# EAGLE design Xonik Waveshaper v1.0 w gp (EAGLE 6.5.0)
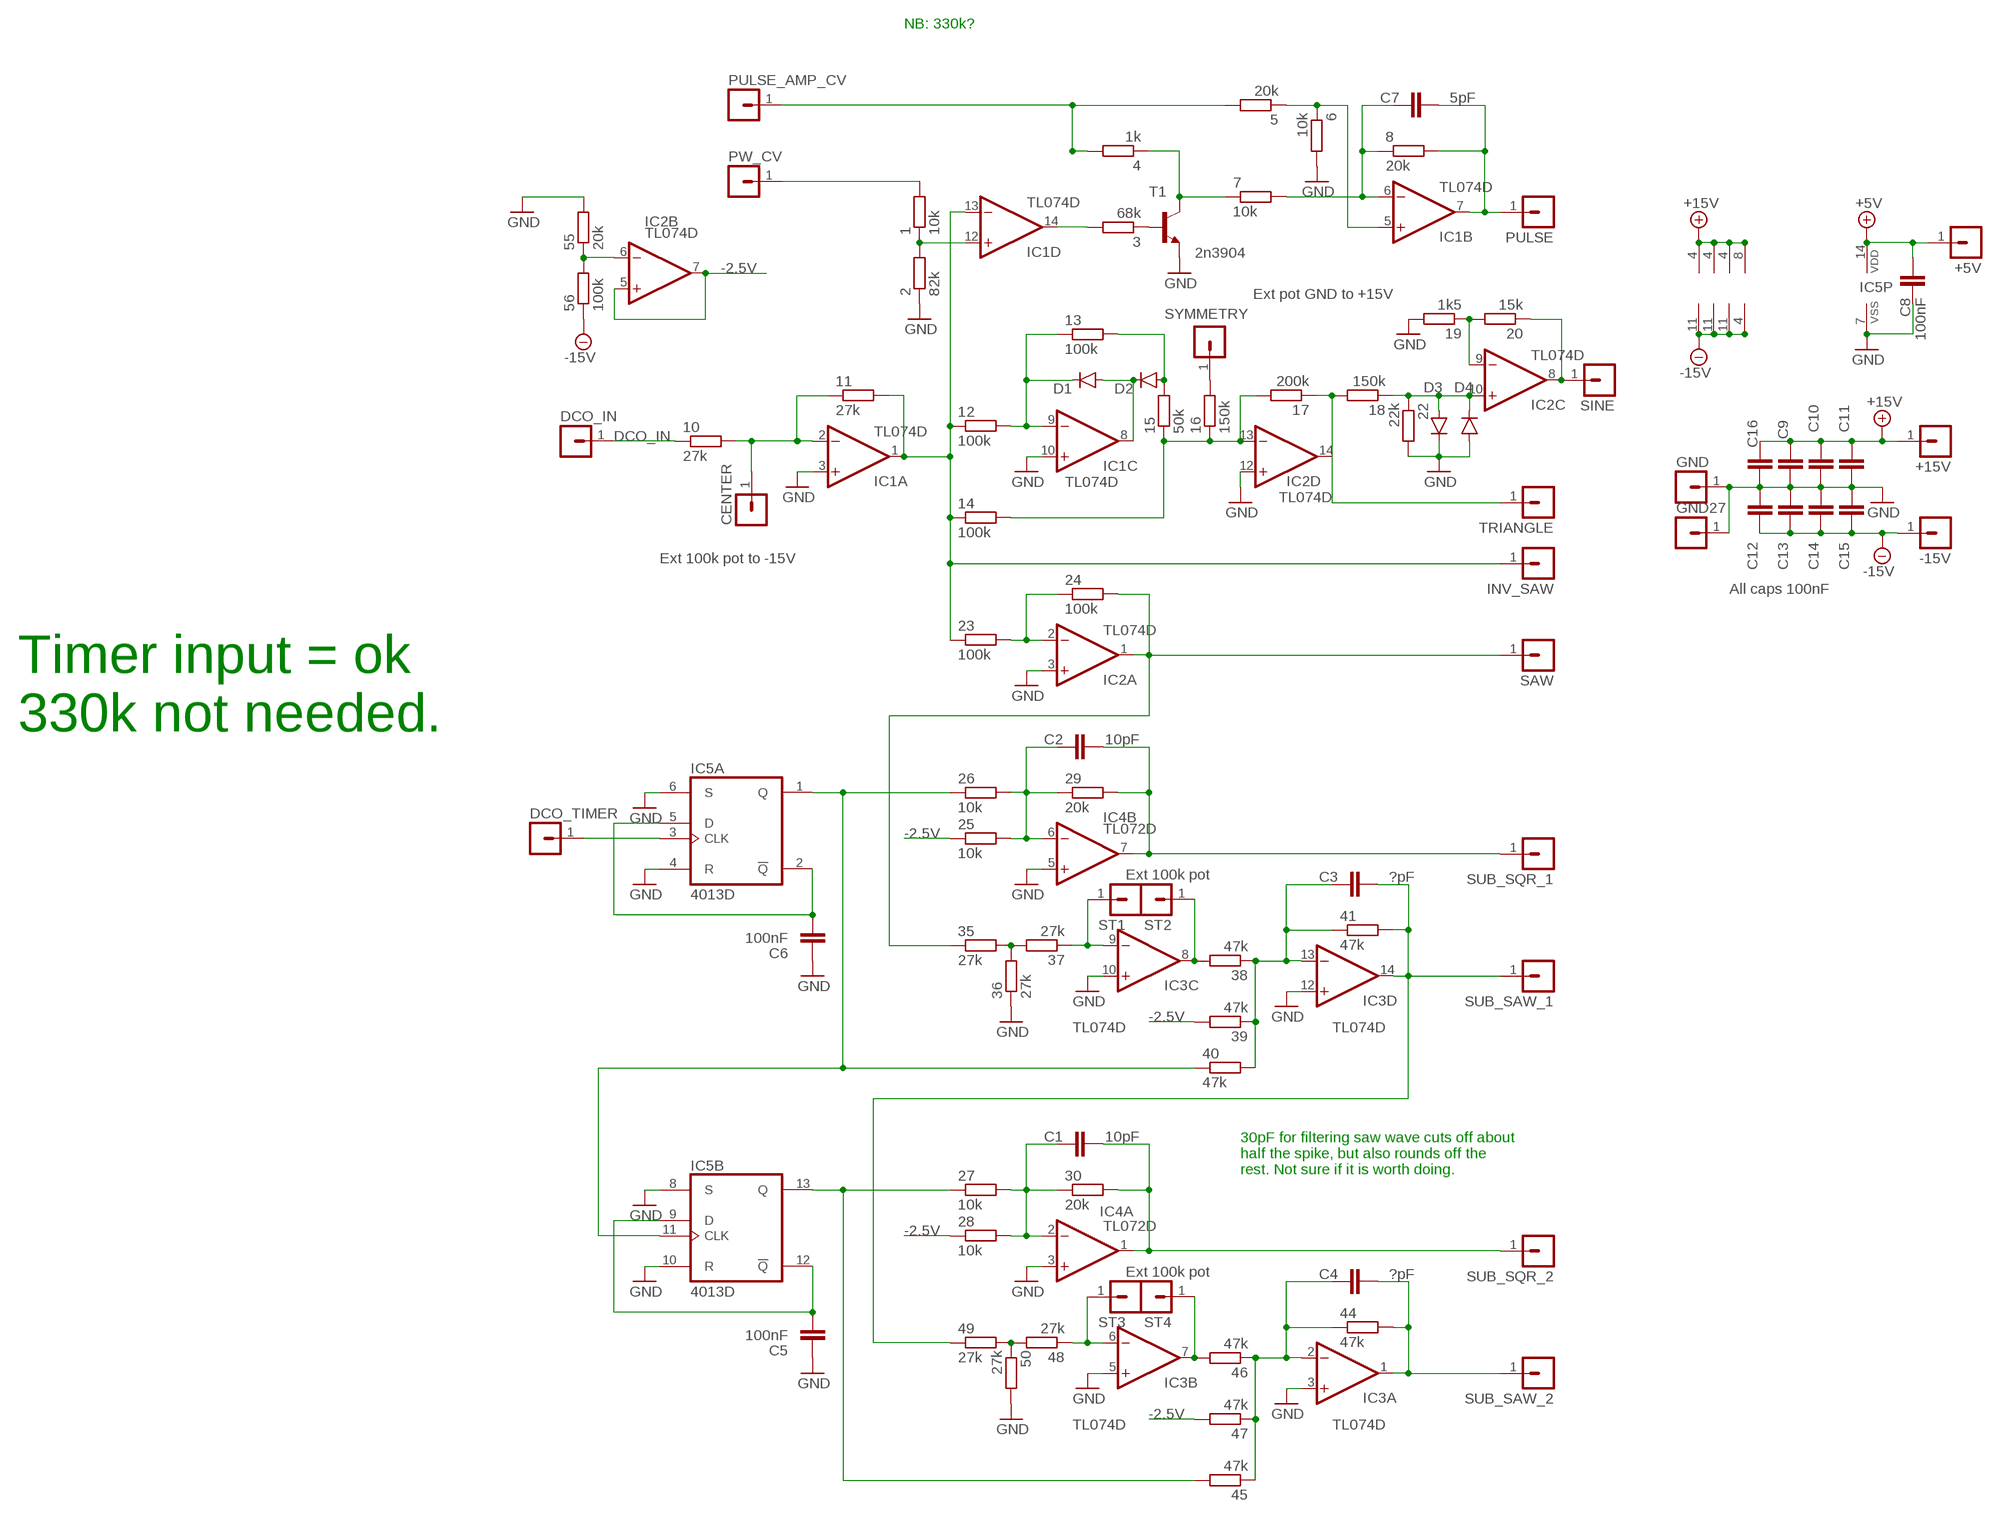
[diagram p0: schematic, sheet 1]

## Parts
1  10k  R-EU_R0805  [R0805]
2  82k  R-EU_R0805  [R0805]
3  68k  R-EU_R0805  [R0805]
4  1k  R-EU_R0805  [R0805]
5  20k  R-EU_R0805  [R0805]
6  10k  R-EU_R0805  [R0805]
7  10k  R-EU_R0805  [R0805]
8  20k  R-EU_R0805  [R0805]
10  27k  R-EU_R0805  [R0805]
11  27k  R-EU_R0805  [R0805]
12  100k  R-EU_R0805  [R0805]
13  100k  R-EU_R0805  [R0805]
14  100k  R-EU_R0805  [R0805]
15  50k  R-EU_R0805  [R0805]
16  150k  R-EU_R0805  [R0805]
17  200k  R-EU_R0805  [R0805]
18  150k  R-EU_R0805  [R0805]
19  1k5  R-EU_R0805  [R0805]
20  15k  R-EU_R0805  [R0805]
22  22k  R-EU_R0805  [R0805]
23  100k  R-EU_R0805  [R0805]
24  100k  R-EU_R0805  [R0805]
25  10k  R-EU_R0805  [R0805]
26  10k  R-EU_R0805  [R0805]
27  10k  R-EU_R0805  [R0805]
28  10k  R-EU_R0805  [R0805]
29  20k  R-EU_R0805  [R0805]
30  20k  R-EU_R0805  [R0805]
35  27k  R-EU_R0805  [R0805]
36  27k  R-EU_R0805  [R0805]
37  27k  R-EU_R0805  [R0805]
38  47k  R-EU_R0805  [R0805]
39  47k  R-EU_R0805  [R0805]
40  47k  R-EU_R0805  [R0805]
41  47k  R-EU_R0805  [R0805]
44  47k  R-EU_R0805  [R0805]
45  47k  R-EU_R0805  [R0805]
46  47k  R-EU_R0805  [R0805]
47  47k  R-EU_R0805  [R0805]
48  27k  R-EU_R0805  [R0805]
49  27k  R-EU_R0805  [R0805]
50  27k  R-EU_R0805  [R0805]
55  20k  R-EU_R0805  [R0805]
56  100k  R-EU_R0805  [R0805]
+5V  MA01-1JP  [SIP-PIN01-1J]
+15V  MA01-1JP  [SIP-PIN01-1J]
-15V  MA01-1JP  [SIP-PIN01-1J]
C1  10pF  C-EUC0805  [C0805]
C2  10pF  C-EUC0805  [C0805]
C3  ?pF  C-EUC0805  [C0805]
C4  ?pF  C-EUC0805  [C0805]
C5  100nF  C-EUC0805  [C0805]
C6  100nF  C-EUC0805  [C0805]
C7  5pF  C-EUC0805  [C0805]
C8  100nF  C-EUC0805  [C0805]
C9  100nF  C-EUC0603K  [C0603K]
C10  100nF  C-EUC0603K  [C0603K]
C11  100nF  C-EUC0603K  [C0603K]
C12  100nF  C-EUC0603K  [C0603K]
C13  100nF  C-EUC0603K  [C0603K]
C14  100nF  C-EUC0603K  [C0603K]
C15  100nF  C-EUC0603K  [C0603K]
C16  100nF  C-EUC0603K  [C0603K]
CENTER  MA01-1JP  [SIP-PIN01-1J]
D1  1N41480805  [D0805-J]
D2  1N41480805  [D0805-J]
D3  1N41480805  [D0805-J]
D4  1N41480805  [D0805-J]
DCO_IN  MA01-1JP  [SIP-PIN01-1J]
DCO_TIMER  MA01-1JP  [SIP-PIN01-1J]
GND  MA01-1JP  [SIP-PIN01-1J]
GND27  MA01-1JP  [SIP-PIN01-1J]
IC1  TL074D  [SO14]
IC2  TL074D  [SO14]
IC3  TL074D  [SO14]
IC4  TL072D  [SO08J]
IC5  4013D  [SO14J]
INV_SAW  MA01-1JP  [SIP-PIN01-1J]
PULSE  MA01-1JP  [SIP-PIN01-1J]
PULSE_AMP_CV  MA01-1JP  [SIP-PIN01-1J]
PW_CV  MA01-1JP  [SIP-PIN01-1J]
SAW  MA01-1JP  [SIP-PIN01-1J]
SINE  MA01-1JP  [SIP-PIN01-1J]
ST1  MA01-1JP  [SIP-PIN01-1J]
ST2  MA01-1JP  [SIP-PIN01-1J]
ST3  MA01-1JP  [SIP-PIN01-1J]
ST4  MA01-1JP  [SIP-PIN01-1J]
SUB_SAW_1  MA01-1JP  [SIP-PIN01-1J]
SUB_SAW_2  MA01-1JP  [SIP-PIN01-1J]
SUB_SQR_1  MA01-1JP  [SIP-PIN01-1J]
SUB_SQR_2  MA01-1JP  [SIP-PIN01-1J]
SYMMETRY  MA01-1JP  [SIP-PIN01-1J]
T1  2n3904  MMBT3904LT1-NPN-SOT23-BEC  [SOT23-BEC]
TRIANGLE  MA01-1JP  [SIP-PIN01-1J]

## Nets
+5V: +5V.1 C8.2 IC5.14(P:VDD)
+15V: +15V.1 C9.2 C10.2 C11.2 C16.2 IC1.4(P:V+) IC2.4(P:V+) IC3.4(P:V+) IC4.8(P:V+)
-2.5V: 25.1 28.1 39.2 47.2 IC2.5(B:+IN) IC2.7(B:OUT)
-15V: 56.1 -15V.1 C12.1 C13.1 C14.1 C15.1 IC1.11(P:V-) IC2.11(P:V-) IC3.11(P:V-) IC4.4(P:V-)
AMP_CV: 4.2 5.2 PULSE_AMP_CV.1
DCO_IN: 10.1 DCO_IN.1
GND: 2.1 6.2 19.2 22.2 36.1 50.2 55.2 C5.1 C6.1 C8.1 C9.1 C10.1 C11.1 C12.2 C13.2 C14.2 C15.2 C16.1 D3.C D4.A GND27.1 GND.1 IC1.3(A:+IN) IC1.10(C:+IN) IC2.3(A:+IN) IC2.12(D:+IN) IC3.3(A:+IN) IC3.5(B:+IN) IC3.10(C:+IN) IC3.12(D:+IN) IC4.3(A:+IN) IC4.5(B:+IN) IC5.4(A:R) IC5.6(A:S) IC5.7(P:VSS) IC5.8(B:S) IC5.10(B:R) T1.E
N$1: 1.1 2.2 IC1.12(D:+IN)
N$2: 3.2 IC1.14(D:OUT)
N$3: 3.1 T1.B
N$4: 4.1 7.1 T1.C
N$5: 5.1 6.1 IC1.5(B:+IN)
N$6: 7.2 8.1 C7.1 IC1.6(B:-IN)
N$7: 8.2 C7.2 IC1.7(B:OUT) PULSE.1
N$9: 11.2 12.1 14.1 23.1 IC1.1(A:OUT) IC1.13(D:-IN) INV_SAW.1
N$10: 10.2 11.1 CENTER.1 IC1.2(A:-IN)
N$11: 12.2 13.1 D1.C IC1.9(C:-IN)
N$12: D1.A D2.C IC1.8(C:OUT)
N$13: 13.2 15.2 D2.A
N$14: 14.2 15.1 16.1 17.2 IC2.13(D:-IN)
N$15: 23.2 24.1 IC2.2(A:-IN)
N$16: 24.2 35.1 IC2.1(A:OUT) SAW.1
N$17: 29.2 C2.2 IC4.7(B:OUT) SUB_SQR_1.1
N$18: 30.2 C1.2 IC4.1(A:OUT) SUB_SQR_2.1
N$19: 25.2 26.2 29.1 C2.1 IC4.6(B:-IN)
N$20: 46.2 IC3.7(B:OUT) ST4.1
N$21: 48.2 49.2 50.1
N$22: 27.2 28.2 30.1 C1.1 IC4.2(A:-IN)
N$23: 35.2 36.2 37.2
N$24: 37.1 IC3.9(C:-IN) ST1.1
N$26: 38.1 39.1 40.2 41.1 C3.1 IC3.13(D:-IN)
N$27: 41.2 49.1 C3.2 IC3.14(D:OUT) SUB_SAW_1.1
N$28: 48.1 IC3.6(B:-IN) ST3.1
N$29: 44.1 45.1 46.1 47.1 C4.1 IC3.2(A:-IN)
N$30: 44.2 C4.2 IC3.1(A:OUT) SUB_SAW_2.1
N$31: C6.2 IC5.2(A:!Q) IC5.5(A:D)
N$32: 26.1 40.1 IC5.1(A:Q) IC5.11(B:CLK)
N$33: 55.1 56.2 IC2.6(B:-IN)
N$34: C5.2 IC5.9(B:D) IC5.12(B:!Q)
N$35: 27.1 45.2 IC5.13(B:Q)
N$36: 19.1 20.2 IC2.9(C:-IN)
N$37: 16.2 SYMMETRY.1
N$38: 17.1 18.2 IC2.14(D:OUT) TRIANGLE.1
N$39: 18.1 22.1 D3.A D4.C IC2.10(C:+IN)
N$40: 20.1 IC2.8(C:OUT) SINE.1
N$41: 38.2 IC3.8(C:OUT) ST2.1
PW_CV: 1.2 PW_CV.1
SQR: DCO_TIMER.1 IC5.3(A:CLK)

## Notes on the sheet
- NB: 330k?
- Ext pot GND to +15V
- Ext 100k pot to -15V
- All caps 100nF
- Timer input = ok
  330k not needed.
- Ext 100k pot
- 30pF for filtering saw wave cuts off about
  half the spike, but also rounds off the
  rest. Not sure if it is worth doing.
- Ext 100k pot

## Library data of the parts
1-8 10-20 22-30 35-41 44-50 55 56 = resistor:R-EU_: RESISTOR, European symbol
+5V +15V -15V CENTER DCO_IN DCO_TIMER GND GND27 INV_SAW PULSE PULSE_AMP_CV PW_CV SAW SINE ST1-ST4 SUB_SAW_1 SUB_SAW_2 SUB_SQR_1 SUB_SQR_2 SYMMETRY TRIANGLE = joakim:MA01-1J: PIN HEADER
C1-C16 = resistor:C-EU: CAPACITOR, European symbol
D1-D4 = joakim:1N4148: DIODE high speed (Philips)
IC1-IC3 = linear:TL074: OP AMP
IC4 = joakim:TL072: OP AMP
IC5 = joakim:4013: Dual D FLIP FLOP, set/reset
T1 = transistor-neu-to92:*-NPN-: NPN Transistror

## Board
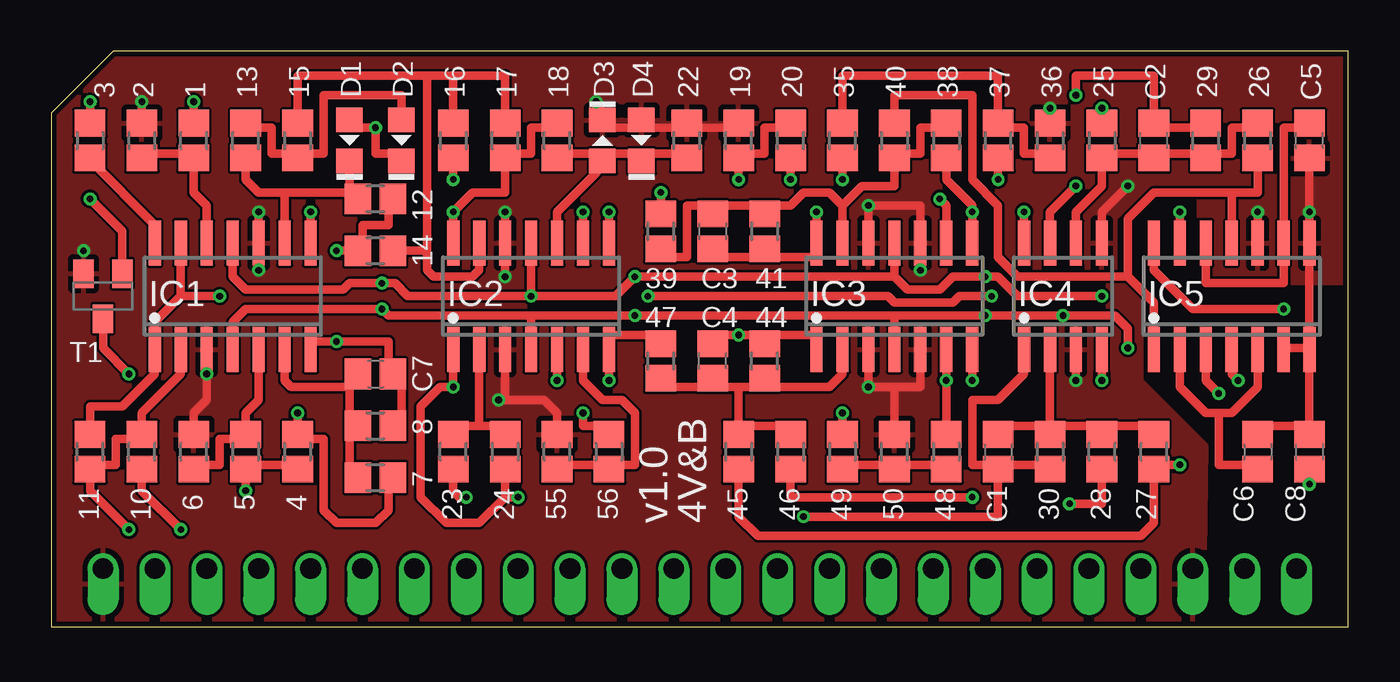
[diagram p1: board, top side]
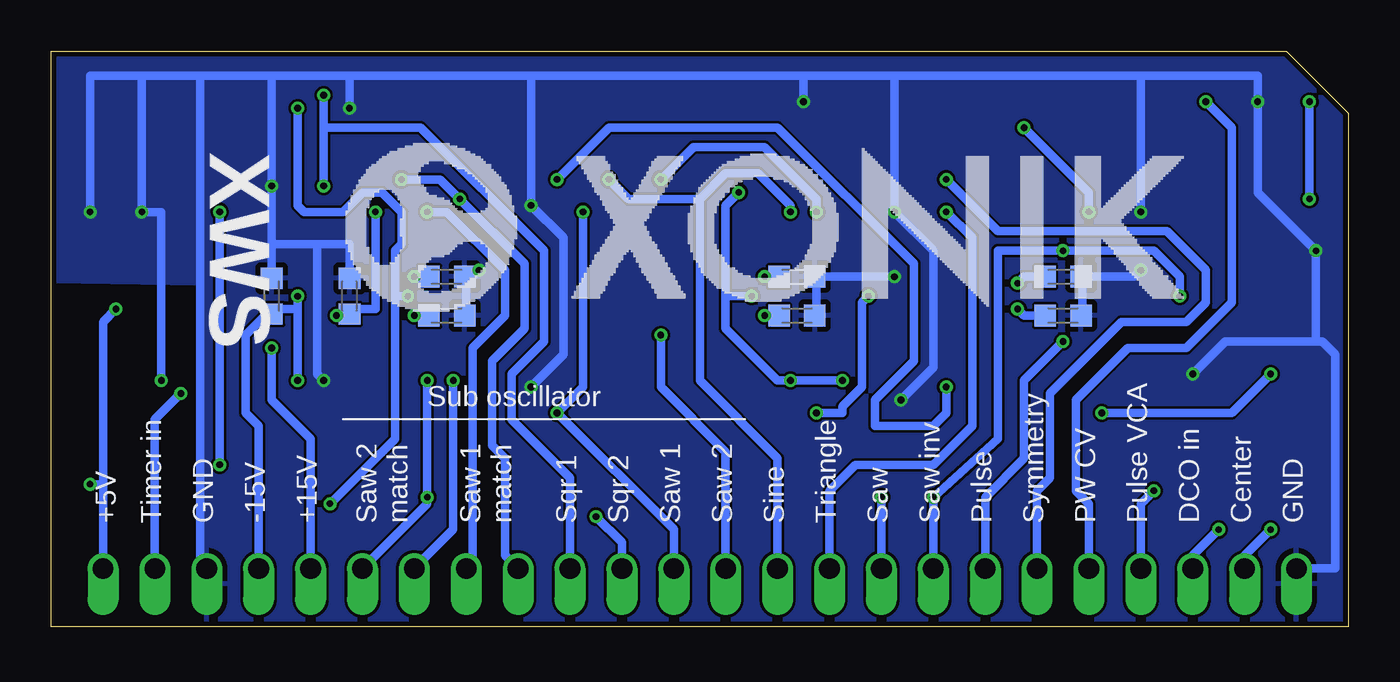
[diagram p2: board, bottom side, seen from below]

Size 63.5 x 28.19 mm. Coordinates in mm from the lower left corner, seen from the top.
Outline: 0,0 63.5,0 63.5,28.19 3.05,28.19 0,25.15 0,0
Copper layers (1*16): Top 0.035mm / dielectric 1.5mm / Bottom 0.035mm
Design rules "dirt_cheap_dirty_boards.v1": minimum track width 5mil, minimum drill 12mil, track to track 5mil, track to pad 5mil, pad to pad 5mil, via to via 5mil, smd to smd 0mil, copper to edge 10mil, drill to drill 10mil, minimum pad ring 10mil, minimum via ring 6mil, stop-mask expansion 2mil, vias tented up to drill 25mil, thermal gap 10mil

### Footprints (pad centres in the part's own frame; a part is rotated, then mirrored left to right if it is on the bottom)
R0805 = smd 1.3 x 1.5: 1 -0.85,0; 2 0.85,0
SIP-PIN01-1J = drill 1.016 offset: 1 0,0
C0805 = smd 1.3 x 1.5: 1 -0.85,0; 2 0.85,0
C0603K = smd 1.05 x 1.08: 1 -0.875,0; 2 0.875,0
D0805-J = smd 1.2 x 1.3: A -1,0; C 1,0
SO14 = smd 0.6 x 2.2: 1 -3.81,-2.6; 2 -2.54,-2.6; 3 -1.27,-2.6; 4 0,-2.6; 5 1.27,-2.6; 6 2.54,-2.6; 7 3.81,-2.6; 8 3.81,2.6; 9 2.54,2.6; 10 1.27,2.6; 11 0,2.6; 12 -1.27,2.6; 13 -2.54,2.6; 14 -3.81,2.6
SO08J = smd 0.6 x 2.2: 1 -1.905,-2.6; 2 -0.635,-2.6; 3 0.635,-2.6; 4 1.905,-2.6; 5 1.905,2.6; 6 0.635,2.6; 7 -0.635,2.6; 8 -1.905,2.6
SO14J = smd 0.6 x 2.2: 1 -3.81,-2.6; 2 -2.54,-2.6; 3 -1.27,-2.6; 4 0,-2.6; 5 1.27,-2.6; 6 2.54,-2.6; 7 3.81,-2.6; 8 3.81,2.6; 9 2.54,2.6; 10 1.27,2.6; 11 0,2.6; 12 -1.27,2.6; 13 -2.54,2.6; 14 -3.81,2.6
SOT23-BEC = smd 1 x 1.4: B -0.95,-1.1; C 0,1.1; E 0.95,-1.1

### Placement (x,y rotation side)
1  6.99,23.81 90 top
2  4.45,23.81 270 top
3  1.91,23.81 270 top
4  12.06,8.57 270 top
5  9.53,8.57 270 top
6  6.99,8.57 90 top
7  15.88,7.3 180 top
8  15.88,9.84 0 top
10  4.45,8.57 90 top
11  1.91,8.57 90 top
12  15.88,20.95 180 top
13  9.53,23.81 90 top
14  15.88,18.41 0 top
15  12.06,23.81 270 top
16  19.68,23.81 270 top
17  22.23,23.81 90 top
18  24.77,23.81 90 top
19  33.66,23.81 90 top
20  36.2,23.81 90 top
22  31.11,23.81 90 top
23  19.68,8.57 90 top
24  22.23,8.57 270 top
25  51.44,23.81 270 top
26  59.05,23.81 90 top
27  53.98,8.57 90 top
28  51.44,8.57 90 top
29  56.52,23.81 90 top
30  48.9,8.57 270 top
35  38.73,23.81 90 top
36  48.9,23.81 270 top
37  46.35,23.81 90 top
38  43.81,23.81 270 top
39  29.84,19.37 90 top
40  41.27,23.81 270 top
41  34.92,19.37 270 top
44  34.92,13.02 90 top
45  33.66,8.57 270 top
46  36.2,8.57 270 top
47  29.84,13.02 90 top
48  43.81,8.57 270 top
49  38.73,8.57 270 top
50  41.27,8.57 90 top
55  24.77,8.57 90 top
56  27.3,8.57 270 top
+5V  60.96,2.86 0 top
+15V  50.8,2.86 0 top
-15V  53.34,2.86 0 top
C1  46.35,8.57 270 top
C2  53.98,23.81 90 top
C3  32.38,19.37 270 top
C4  32.38,13.02 90 top
C5  61.59,23.81 90 top
C6  59.05,8.57 270 top
C7  15.88,12.38 0 top
C8  61.59,8.57 270 top
C9  44.13,15.24 180 bottom
C10  26.99,15.24 180 bottom
C11  13.97,15.24 180 bottom
C12  52.7,16.19 90 bottom
C13  44.13,17.14 0 bottom
C14  26.99,17.14 0 bottom
C15  13.97,17.14 0 bottom
C16  48.9,16.19 270 bottom
CENTER  5.08,2.86 0 top
D1  14.61,23.81 270 top
D2  17.14,23.81 270 top
D3  26.99,23.81 90 top
D4  28.89,23.81 270 top
DCO_IN  7.62,2.86 0 top
DCO_TIMER  58.42,2.86 0 top
GND  55.88,2.86 0 top
GND27  2.54,2.86 0 top
IC1  8.89,16.19 0 top
IC2  23.5,16.19 0 top
IC3  41.27,16.19 0 top
IC4  49.53,16.19 0 top
IC5  57.78,16.19 0 top
INV_SAW  20.32,2.86 0 top
PULSE  17.78,2.86 0 top
PULSE_AMP_CV  10.16,2.86 0 top
PW_CV  12.7,2.86 0 top
SAW  22.86,2.86 0 top
SINE  27.94,2.86 0 top
ST1  40.64,2.86 0 top
ST2  43.18,2.86 0 top
ST3  45.72,2.86 0 top
ST4  48.26,2.86 0 top
SUB_SAW_1  33.02,2.86 0 top
SUB_SAW_2  30.48,2.86 0 top
SUB_SQR_1  38.1,2.86 0 top
SUB_SQR_2  35.56,2.86 0 top
SYMMETRY  15.24,2.86 0 top
T1  2.54,16.19 180 top
TRIANGLE  25.4,2.86 0 top

### Tracks (layer width: path | path; a pad name or v marks a point on that pad's centre or on a via)
+5V  (via drill 0.33)
  Top 0.406: v60.33,15.56 55.88,15.56 53.98,17.46 IC5.14 | C8.2 v61.59,6.99
  Bottom 0.406: +5V.1 60.96,6.99 | 60.96,6.99 60.96,14.92 v60.33,15.56 | v61.59,6.99 60.96,6.99
+15V  (via drill 0.33)
  Top 0.406: IC1.4 8.89,14.92 9.53,15.56 v16.19,15.56 16.51,15.24 23.5,15.24 | 23.5,15.24 v28.57,15.24 41.27,15.24 | 41.27,15.24 v45.72,15.24 v49.53,15.24 52.07,15.24 52.7,14.61 v52.7,13.65 | IC2.4 23.5,15.24 | IC3.4 41.27,15.24 | IC4.8 v47.62,20.32
  Bottom 0.406: +15V.1 50.8,9.21 52.7,11.11 v52.7,13.65 | v47.62,20.32 47.62,15.56 48.34,15.56 | 48.34,15.56 v49.53,15.24 | C11.2 15.88,15.24 v16.19,15.56 | v28.57,15.24 C10.2 | 45.09,15.56 C9.2 v45.72,15.24 | 48.34,15.56 C16.2
-2.5V  (via drill 0.33)
  Top 0.406: v29.21,16.19 40.96,16.19 41.27,15.88 44.13,15.88 44.45,16.19 v46.04,16.19 | 28.1 51.44,6.03 v49.85,6.03 | v51.44,25.4 25.1 | v27.3,12.06 IC2.7 27.3,14.29 29.84,14.29 47.2 | 39.2 v29.84,21.27 | IC2.5 v24.77,12.06
  Bottom 0.406: 30.48,16.19 30.48,20.64 v29.84,21.27 | v49.85,6.03 46.67,9.21 46.67,16.19 | v46.04,16.19 46.67,16.19 | 46.67,16.19 46.67,18.41 46.35,18.73 46.35,20.32 47.31,21.27 48.26,21.27 49.21,20.32 51.12,20.32 51.44,20.64 v51.44,25.4 | 30.48,16.19 30.48,14.61 27.94,12.06 v27.3,12.06 v24.77,12.06 | 30.48,16.19 v29.21,16.19
-15V  (via drill 0.33)
  Top 0.406: IC1.11 8.89,17.14 9.53,16.51 14.29,16.51 14.61,16.83 v16.19,16.83 16.83,16.83 17.46,16.19 v23.5,16.19 | v23.5,16.19 27.62,16.19 v28.57,17.14 41.27,17.14 | 41.27,17.14 41.91,16.51 43.5,16.51 44.13,17.14 v45.72,17.14 46.35,17.14 47.31,16.19 v51.44,16.19 | IC3.11 41.27,17.14 | IC2.11 v23.5,16.19 | 56.1 27.3,9.84 26.04,9.84 v26.04,10.48 | IC4.4 v51.44,12.06
  Bottom 0.406: v26.04,10.48 24.77,10.48 24.77,10.79 23.81,11.75 23.81,15.88 v23.5,16.19 | -15V.1 53.34,9.84 53.98,10.48 53.98,14.29 52.7,15.56 | 52.7,15.56 51.44,15.56 v51.44,16.19 v51.44,12.06 | C15.1 15.88,17.14 v16.19,16.83 | v28.57,17.14 C14.1 | C13.1 v45.72,17.14 | 52.7,15.56 C12.1
AMP_CV  (via drill 0.33)
  Top 0.406: v9.53,6.67 5.2 9.95,7.94 12.06,7.94 4.2
  Bottom 0.406: v9.53,6.67 10.16,6.03 PULSE_AMP_CV.1
DCO_IN  (via drill 0.33)
  Top 0.406: 10.1 4.45,6.67 v6.35,4.76
  Bottom 0.406: v6.35,4.76 7.62,3.49 DCO_IN.1
GND  (via drill 0.33)
  Top 0.305: 61.59,13.65 IC5.7
  Top 0.406: IC3.12 v40.01,20.64 42.55,20.64 IC3.10 v42.55,17.46 | IC3.5 42.55,11.75 41.27,11.75 | IC3.3 v40.01,11.75 41.27,11.75 | C5.1 v61.59,20.32 IC5.8 61.59,13.65 60.33,13.65 IC5.6 | v52.7,21.59 51.44,20.32 IC4.5 | 41.27,11.75 50.2 | v22.23,20.32 IC2.12 v22.23,17.14 | IC2.3 22.23,11.11 v21.91,11.11 24.13,11.11 24.77,10.48 55.2 | IC5.10 v59.05,20.32 | IC4.3 v50.16,12.06 | 29.21,24.45 26.99,24.45 D3.C v26.67,25.72 | 29.21,24.45 31.43,24.45 | D4.A 29.21,24.45 | 22.2 31.43,24.45 | 31.43,24.45 33.66,24.45 19.2 | IC5.4 57.78,12.38 v58.1,12.06 | 6.2 6.99,10.48 7.62,11.11 IC1.3 v7.62,12.38 | v10.16,20.32 IC1.10 v10.16,17.46 | 2.1 v4.45,25.72 | C6.1 59.05,9.53 59.37,9.84 61.17,9.84 | 61.17,9.84 C8.1 | 61.17,9.84 61.59,9.84 IC5.7 | 36.1 v48.9,25.4
  Bottom 0.406: v61.59,20.32 61.59,26.99 59.05,26.99 | 59.05,26.99 56.2,26.99 | 56.2,26.99 52.7,26.99 | 52.7,26.99 v52.7,21.59 52.7,18.73 | 40.01,26.99 v40.01,20.64 38.42,19.05 38.42,13.34 v40.01,11.75 | 40.01,26.99 48.9,26.99 | 48.9,26.99 52.7,26.99 | 26.67,26.99 40.01,26.99 | v21.91,11.11 20.32,12.7 20.32,18.41 v22.23,20.32 22.23,26.99 | 59.05,26.99 v59.05,20.32 58.1,20.32 v58.1,12.06 | GND.1 56.2,3.17 56.2,26.99 | v50.16,12.06 50.48,12.38 50.48,18.73 | v10.16,20.32 10.16,26.99 | 10.16,26.99 22.23,26.99 | 22.23,26.99 26.67,26.99 | 26.67,26.99 v26.67,25.72 | 10.16,26.99 4.45,26.99 v4.45,25.72 4.45,21.27 v1.59,18.41 1.59,13.97 | GND27.1 0.64,2.86 0.64,13.34 1.27,13.97 1.59,13.97 | 1.59,13.97 6.03,13.97 v7.62,12.38 | v10.16,17.46 10.48,17.14 C15.2 13.02,17.07 13.02,15.24 C11.1 | v22.23,17.14 C14.2 26.04,17.07 26.04,15.24 C10.1 | C9.1 43.18,15.32 43.18,17.14 C13.2 42.86,17.14 v42.55,17.46 | C16.1 48.9,18.73 50.48,18.73 | C12.2 52.7,18.73 | 52.7,18.73 50.48,18.73 | v48.9,25.4 48.9,26.99
  pour Top: 0,0 -0.06,25.08 3.17,28.26 63.5,28.26 63.5,16.83 56.52,16.83 56.2,17.14 56.2,21.59 53.98,21.59 52.07,20 52.07,17.14 53.34,15.88 53.34,12.06 56.52,8.89 56.39,0
  pour Bottom: 0,0 0,28.45 63.5,28.26 63.5,16.95 56.2,16.83 56.2,3.17 56.52,2.86 56.52,-0.06
N$1
  Top 0.406: IC1.12 7.62,20.64 6.99,21.27 1.1 6.99,23.18 4.87,23.18 2.2
N$2
  Top 0.406: 3.2 1.91,22.86 5.08,19.68 IC1.14
N$3  (via drill 0.33)
  Top 0.406: v1.91,20.95 3.49,19.37 3.49,16.98 T1.B | v1.91,25.72 3.1
  Bottom 0.406: v1.91,20.95 v1.91,25.72
N$4  (via drill 0.33)
  Top 0.406: T1.C 2.54,13.65 v3.81,12.38 | v12.06,10.48 4.1 12.06,9.21 13.34,9.21 13.34,5.71 13.97,5.08 15.88,5.08 16.51,5.71 16.51,6.67 7.1
  Bottom 0.406: v3.81,12.38 5.71,10.48 v12.06,10.48
N$5
  Top 0.406: 6.1 6.99,7.94 8.26,7.94 8.26,9.21 9.53,9.21 5.1 9.53,10.48 10.16,11.11 IC1.5
N$6
  Top 0.406: IC1.6 11.43,12.06 11.75,11.75 14.61,11.75 14.61,11.96 C7.1 14.61,12.38 14.61,10.58 8.1 14.61,9.84 14.61,7.3 7.2
N$7  (via drill 0.33)
  Top 0.406: IC1.7 12.7,13.97 v13.97,13.97 16.51,13.97 16.51,12.7 C7.2 17.14,11.96 17.14,10.16 16.83,9.84 8.2
  Bottom 0.406: PULSE.1 17.78,6.35 15.88,8.26 15.88,12.06 v13.97,13.97
N$9  (via drill 0.33)
  Top 0.406: 11.2 1.91,10.79 3.49,10.79 5.08,12.38 IC1.1 5.08,14.92 6.35,16.19 | 6.35,16.19 IC1.13 | 14.1 15.24,18.73 | 15.24,18.73 15.24,19.68 16.51,19.68 16.51,20.85 12.1 | 15.24,18.73 15.24,18.41 v13.97,18.41 | v8.26,16.19 6.35,16.19 | 23.1 19.68,6.67 20,6.35 v20.32,6.35
  Bottom 0.406: v8.26,16.19 8.26,17.14 9.53,18.41 v13.97,18.41 17.14,18.41 17.14,9.21 v20.32,6.35 INV_SAW.1
N$10  (via drill 0.33)
  Top 0.406: IC1.2 6.35,12.38 4.45,10.48 10.2 4.45,9.21 3.17,9.21 3.17,7.94 1.91,7.94 11.1 1.91,6.67 v3.81,4.76
  Bottom 0.406: v3.81,4.76 5.08,3.49 CENTER.1
N$11
  Top 0.406: 13.1 9.53,21.91 10.16,21.27 11.43,21.27 | 11.43,21.27 IC1.9 | 14.61,21.27 15.24,21.27 15.03,21.06 12.2 | 14.61,21.27 11.43,21.27 | D1.C 14.61,21.27
N$12  (via drill 0.33)
  Top 0.406: v12.7,20.32 IC1.8 | 14.61,25.08 D1.A 14.61,24.45 v15.88,24.45 15.88,23.18 17.14,23.18 D2.C
  Bottom 0.406: v15.88,24.45 12.7,21.27 v12.7,20.32
N$13
  Top 0.406: 13.2 9.53,24.45 10.79,24.45 10.79,23.18 11.64,23.18 15.2 12.06,23.18 13.34,23.18 13.34,26.04 17.14,26.04 D2.A
N$14
  Top 0.406: 15.1 12.06,26.99 18.41,26.99 | 18.41,26.99 19.68,26.99 | 19.68,26.99 16.1 | 17.2 22.23,26.99 19.68,26.99 | 14.2 18.41,18.41 | 18.41,18.41 18.41,26.99 | IC2.13 20.95,17.46 20.64,17.14 18.73,17.14 18.41,17.46 18.41,18.41
N$15
  Top 0.406: 23.2 19.68,9.84 20.95,9.84 | 24.1 21.8,9.84 20.95,9.84 | 20.95,9.84 IC2.2
N$16  (via drill 0.33)
  Top 0.406: 24.2 22.23,6.35 | IC2.1 v19.68,11.75 19.05,11.75 18.1,10.79 18.1,6.35 19.37,5.08 20.95,5.08 22.23,6.35 | 35.1 v38.73,21.91 | v22.86,6.35 22.23,6.35
  Bottom 0.406: v19.68,11.75 19.68,10.48 20.32,9.84 23.18,9.84 23.18,11.11 21.27,13.02 21.27,17.78 27.94,24.45 36.2,24.45 v38.73,21.91 | v22.86,6.35 SAW.1
N$17  (via drill 0.33)
  Top 0.406: 29.2 56.2,24.45 54.08,24.45 C2.2 53.98,26.99 50.16,26.99 v50.16,26.04 | IC4.7 48.9,20.32 v50.16,21.59
  Bottom 0.406: 50.16,24.45 45.4,24.45 39.37,18.41 39.37,13.97 40.96,12.38 40.96,10.16 38.1,7.3 SUB_SQR_1.1 | v50.16,21.59 50.16,24.45 | v50.16,26.04 50.16,24.45
N$18  (via drill 0.33)
  Top 0.406: IC4.1 47.62,12.38 46.35,11.11 45.09,11.11 45.09,7.94 45.94,7.94 C1.2 | C1.2 46.35,5.4 v36.83,5.4 | C1.2 46.35,7.62 46.67,7.94 48.48,7.94 30.2
  Bottom 0.406: SUB_SQR_2.1 35.56,4.13 v36.83,5.4
N$19
  Top 0.406: 56.52,23.18 54.29,23.18 | C2.1 54.29,23.18 | 54.29,23.18 51.54,23.18 25.2 51.44,21.59 50.16,20.32 IC4.6 | 29.1 56.52,23.18 | 56.52,23.18 57.78,23.18 57.78,24.45 59.05,24.45 26.2
N$20  (via drill 0.33)
  Top 0.406: 46.2 36.2,6.35 v45.09,6.35 | IC3.7 v45.09,12.06
  Bottom 0.406: v45.09,12.06 v45.09,6.35 45.09,6.03 ST4.1
N$21
  Top 0.406: 48.2 43.81,7.94 41.7,7.94 50.1 41.06,7.94 38.73,7.94 49.2
N$22
  Top 0.406: 48.9,9.84 IC4.2 | C1.1 46.35,9.84 48.9,9.84 | 27.2 53.55,9.84 51.44,9.84 | 48.9,9.84 30.1 48.9,9.53 49.21,9.84 51.44,9.84 | 28.2 51.44,9.84
N$23
  Top 0.406: 35.2 38.73,26.99 46.35,26.99 46.35,24.77 | 37.2 46.35,24.77 | 46.35,24.77 46.67,24.45 47.62,24.45 47.62,23.18 48.26,23.18 48.48,22.96 36.2
N$24  (via drill 0.33)
  Top 0.406: IC3.9 43.81,20.64 v43.5,20.95 | 37.1 v46.35,21.91
  Bottom 0.406: ST1.1 41.27,3.49 41.27,8.26 41.91,8.89 41.91,13.02 40.32,14.61 40.32,17.78 v43.5,20.95 44.45,21.91 v46.35,21.91
N$26
  Top 0.406: IC3.13 38.73,20.64 | 38.73,20.64 39.69,21.59 41.27,21.59 40.2 41.27,23.18 42.55,23.18 42.55,24.45 43.18,24.45 43.4,24.66 38.1 | 38.73,20.64 38.1,21.27 36.83,21.27 36.2,20.64 34.92,20.64 | 34.92,20.64 32.8,20.64 C3.1 32.38,20.64 31.11,20.64 31.11,18.1 29.84,18.1 39.1 | 41.1 34.92,20.64
N$27  (via drill 0.33)
  Top 0.406: 35.34,18.1 41.2 34.92,18.1 | 34.92,18.1 32.8,18.1 C3.2 | v37.47,20.32 IC3.14 37.47,18.1 35.34,18.1 | 35.34,18.1 34.92,18.1 | 49.1 v38.73,10.48
  Bottom 0.406: v37.47,20.32 37.47,11.75 v38.73,10.48 33.02,4.76 SUB_SAW_1.1
N$28  (via drill 0.33)
  Top 0.406: IC3.6 v43.81,12.06 48.1 43.81,9.21
  Bottom 0.406: v43.81,12.06 43.81,4.76 ST3.1
N$29
  Top 0.406: 46.1 36.2,9.84 34.08,9.84 45.1 33.66,11.75 | IC3.2 38.73,12.38 38.1,11.75 34.92,11.75 | 47.1 29.84,11.75 31.96,11.75 C4.1 32.38,11.75 33.66,11.75 | 33.66,11.75 34.51,11.75 | 34.51,11.75 44.1 34.92,11.75 | 34.92,11.75 34.51,11.75
N$30  (via drill 0.33)
  Top 0.406: C4.2 32.38,14.29 34.51,14.29 44.2 34.92,14.29 v33.66,14.29 37.47,14.29 IC3.1
  Bottom 0.406: v33.66,14.29 33.66,11.75 30.48,8.57 SUB_SAW_2.1
N$31
  Top 0.406: C6.2 59.05,7.94 57.15,7.94 57.15,10.48 | 57.15,10.48 57.78,10.48 59.05,11.75 IC5.5 | IC5.2 55.24,11.75 56.52,10.48 57.15,10.48
N$32
  Top 0.406: IC5.11 57.78,21.27 | 57.78,21.27 59.05,21.27 26.1 | IC5.1 53.98,15.88 52.7,17.14 | 57.78,21.27 53.98,21.27 52.7,20 52.7,17.14 | 52.7,17.14 47.31,17.14 46.35,18.1 46.35,20.64 45.09,21.91 45.09,26.04 41.27,26.04 40.1
N$33
  Top 0.406: 55.1 25.18,7.94 27.3,7.94 56.2 27.73,7.94 28.57,7.94 28.57,10.48 27.94,11.11 26.99,11.11 26.04,12.06 IC2.6
N$34
  Top 0.406: C5.2 61.59,24.45 60.33,24.45 IC5.9 60.33,16.83 56.52,16.83 IC5.12
N$35  (via drill 0.33)
  Top 0.406: v55.24,7.94 53.98,7.94 27.1 53.98,5.08 53.34,4.45 34.61,4.45 33.66,5.4 45.2 | v55.24,20.32 IC5.13
  Bottom 0.406: v55.24,7.94 v55.24,20.32
N$36  (via drill 0.33)
  Top 0.406: IC2.9 v26.04,20.32 | 20.2 36.2,24.45 34.92,24.45 34.92,23.18 34.29,23.18 19.1 v33.66,21.91
  Bottom 0.406: v26.04,20.32 26.04,20.95 28.57,23.5 32.07,23.5 v33.66,21.91
N$37  (via drill 0.33)
  Top 0.406: 16.2 v19.68,21.91
  Bottom 0.406: v19.68,21.91 17.14,19.37 8.89,19.37 6.99,17.46 6.99,15.88 7.94,14.92 11.11,14.92 14.61,11.43 14.61,7.3 15.24,6.67 SYMMETRY.1
N$38  (via drill 0.33)
  Top 0.406: IC2.14 v19.68,20.32 20.64,21.27 22.23,21.27 17.1 22.64,23.18 23.5,23.18 23.5,24.45 24.77,24.45 18.2
  Bottom 0.406: TRIANGLE.1 25.4,6.67 24.13,7.94 20.32,7.94 18.41,9.84 18.41,19.05 v19.68,20.32
N$39
  Top 0.406: IC2.10 24.77,20.32 26.67,22.23 D3.A | D3.A 26.67,23.18 28.57,23.18 | 29.26,23.18 D4.C 28.57,23.18 | 28.57,23.18 29.26,23.18 | 29.26,23.18 31.01,23.18 22.1 | 18.1 24.77,23.18 26.4,23.18 D3.A
N$40  (via drill 0.33)
  Top 0.406: v27.3,20.32 IC2.8 | 20.1 v36.2,21.91
  Bottom 0.406: SINE.1 27.94,8.26 31.75,12.06 31.75,20.95 | 31.75,20.95 30.48,22.23 28.89,22.23 27.3,20.64 v27.3,20.32 | v36.2,21.91 35.24,20.95 31.75,20.95
N$41  (via drill 0.33)
  Top 0.406: IC3.8 v45.09,20.32 45.09,20.64 43.81,21.91 38.2
  Bottom 0.406: v45.09,20.32 44.13,20.32 41.27,17.46 41.27,15.24 42.86,13.65 42.86,3.17 ST2.1
PW_CV  (via drill 0.33)
  Top 0.406: 1.2 v6.99,25.72
  Bottom 0.406: v6.99,25.72 5.71,24.45 5.71,15.88 7.94,13.65 10.79,13.65 13.34,11.11 13.34,6.67 12.7,6.03 PW_CV.1
SQR  (via drill 0.33)
  Top 0.406: IC5.3 56.52,12.06 v57.15,11.43
  Bottom 0.406: v57.15,11.43 58.42,10.16 DCO_TIMER.1

### Text on the board
tNames: 3 | 2 | 1 | 13 | 15 | D1 | D2 | 16 | 17 | 18 | D3 | D4 | 22 | 19 | 20 | 35 | 40 | 38 | 37 | 36 | 25 | C2 | 29 | 26 | C5 | 12 | 14 | 39 | C3 | 41 | IC1 | IC2 | IC3 | IC4 | IC5 | 47 | C4 | 44 | T1 | C7 | 8 | 11 | 10 | 7 | 23 | 24 | 55 | 56 | 45 | 46 | 49 | 50 | 48 | C1 | 30 | 28 | 27 | C6 | C8 | 6 | 5 | 4 | v1.0 | 4V&B
bNames: XWS | Sub oscillator | GND | Center | DCO in | Pulse VCA | PW CV | Symmetry | Pulse | Saw inv | Saw | Triangle | Sine | Saw 2 | Saw 1 | Sqr 2 | Sqr 1 | Saw 1 / match | Saw 2 / match | +15V | -15V | GND | Timer in | +5V